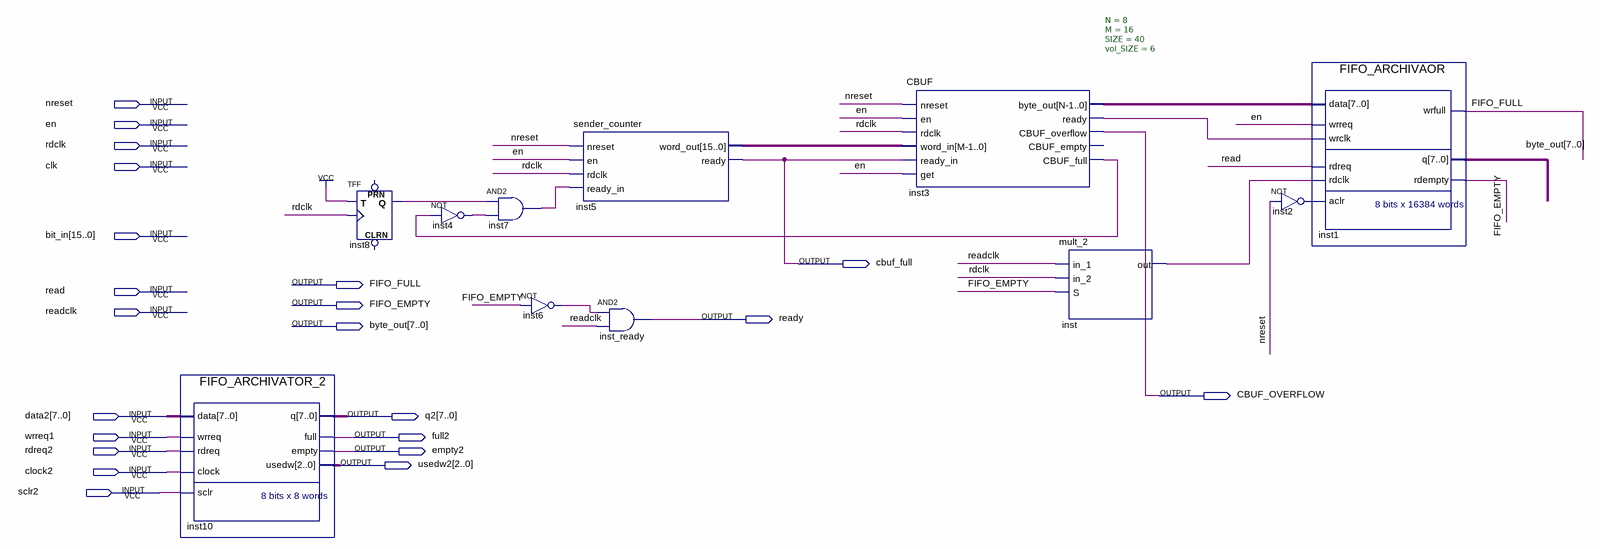
[diagram p0: schematic sheet]
// Quartus schematic ARCHIVATOR_testbench.bdf as structural Verilog: 11 symbols, 22 pins
module ARCHIVATOR_testbench (
  input  nreset,
  input  en,
  input  rdclk,
  input  clk,
  input  [15:0] bit_in,
  input  read,
  input  readclk,
  input  [7:0] data2,
  input  wrreq1,
  input  rdreq2,
  input  clock2,
  input  sclr2,
  output cbuf_full,
  output FIFO_FULL,
  output FIFO_EMPTY,
  output ready,
  output [7:0] byte_out,
  output CBUF_OVERFLOW,
  output [7:0] q2,
  output full2,
  output empty2,
  output [2:0] usedw2
);

  wire inst2_out, inst3_cbuf_full, inst3_ready, inst4_out, inst6_out, inst7_out, inst8_q, inst_out;
  wire [7:0] inst3_byte_out;
  wire [15:0] inst5_word_out;

  FIFO_ARCHIVATOR_2 inst10 (
    .data(data2), .wrreq(wrreq1), .rdreq(rdreq2), .clock(clock2), .sclr(sclr2), .q(q2), .full(full2),
    .empty(empty2), .usedw(usedw2));
  TFF inst8 (.T(1'b1), .CLK(rdclk), .Q(inst8_q));  // open: PRN, CLRN
  not inst4 (inst4_out, inst3_cbuf_full);
  and inst7 (inst7_out, inst8_q, inst4_out);
  not inst6 (inst6_out, FIFO_EMPTY);
  sender_counter inst5 (
    .nreset(nreset), .en(en), .rdclk(rdclk), .ready_in(inst7_out), .word_out(inst5_word_out),
    .ready(cbuf_full));
  and inst_ready (ready, inst6_out, readclk);
  CBUF #(.N(8), .M(16), .SIZE(40), .vol_SIZE(6)) inst3 (
    .nreset(nreset), .en(en), .rdclk(rdclk), .word_in(inst5_word_out), .ready_in(cbuf_full), .get(en),
    .byte_out(inst3_byte_out), .ready(inst3_ready), .CBUF_overflow(CBUF_OVERFLOW), .CBUF_full(inst3_cbuf_full));  // open: CBUF_empty
  mult_2 inst (.in_1(readclk), .in_2(rdclk), .S(FIFO_EMPTY), .out(inst_out));
  not inst2 (inst2_out, nreset);
  FIFO_ARCHIVAOR inst1 (
    .data(inst3_byte_out), .wrreq(en), .wrclk(inst3_ready), .rdreq(read), .rdclk(inst_out), .aclr(inst2_out),
    .wrfull(FIFO_FULL), .q(byte_out), .rdempty(FIFO_EMPTY));
endmodule
